# EAGLE design MouseGoggles EyeTrack Hat-1-1 (EAGLE 9.6.2)
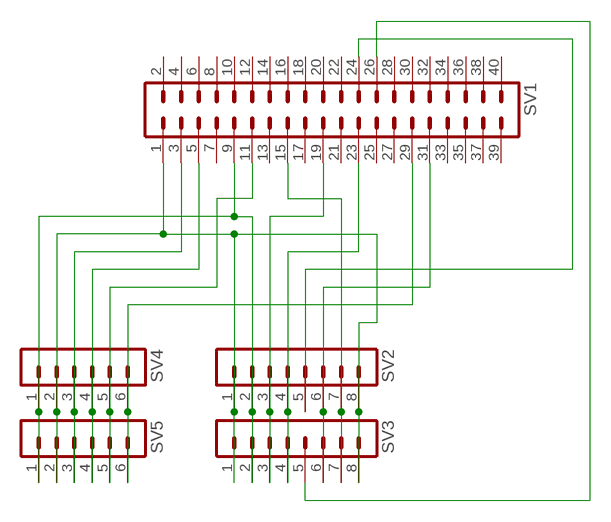
[diagram p0: schematic, sheet 1]

## Parts
SV1  MA20-2  [MA20-2]
SV2  MA08-1  [MA08-1]
SV3  MA08-1  [MA08-1]
SV4  MA06-1  [MA06-1]
SV5  MA06-1  [MA06-1]

## Nets
N$1: SV1.1 SV2.1 SV2.8 SV3.1 SV3.8 SV4.2 SV5.2
N$2: SV1.9 SV2.2 SV3.2 SV4.1 SV5.1
N$3: SV1.19 SV2.3 SV3.3
N$4: SV1.23 SV2.4 SV3.4
N$5: SV1.24 SV2.5
N$6: SV1.26 SV3.5
N$7: SV1.31 SV2.6 SV3.6
N$8: SV1.15 SV2.7 SV3.7
N$9: SV1.3 SV4.3 SV5.3
N$10: SV1.5 SV4.4 SV5.4
N$11: SV1.11 SV4.5 SV5.5
N$12: SV1.29 SV4.6 SV5.6
Unconnected: SV1.2 SV1.4 SV1.6 SV1.7 SV1.8 SV1.10 SV1.12 SV1.13 SV1.14 SV1.16 SV1.17 SV1.18 SV1.20 SV1.21 SV1.22 SV1.25 SV1.27 SV1.28 SV1.30 SV1.32 SV1.33 SV1.34 SV1.35 SV1.36 SV1.37 SV1.38 SV1.39 SV1.40

## Library data of the parts
SV1 = con-lstb:MA20-2: PIN HEADER; OC_FARNELL: unknown; OC_NEWARK: unknown
SV2 SV3 = con-lstb:MA08-1: PIN HEADER; OC_FARNELL: unknown; OC_NEWARK: unknown
SV4 SV5 = con-lstb:MA06-1: PIN HEADER; OC_FARNELL: unknown; OC_NEWARK: unknown

## Board
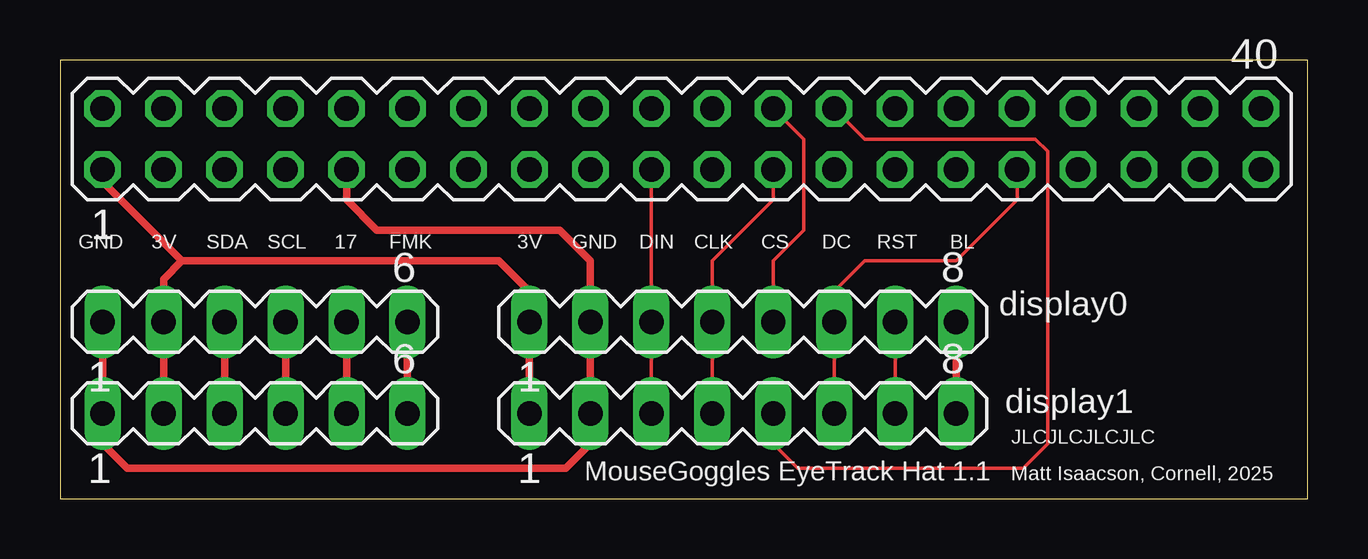
[diagram p1: board, top side]
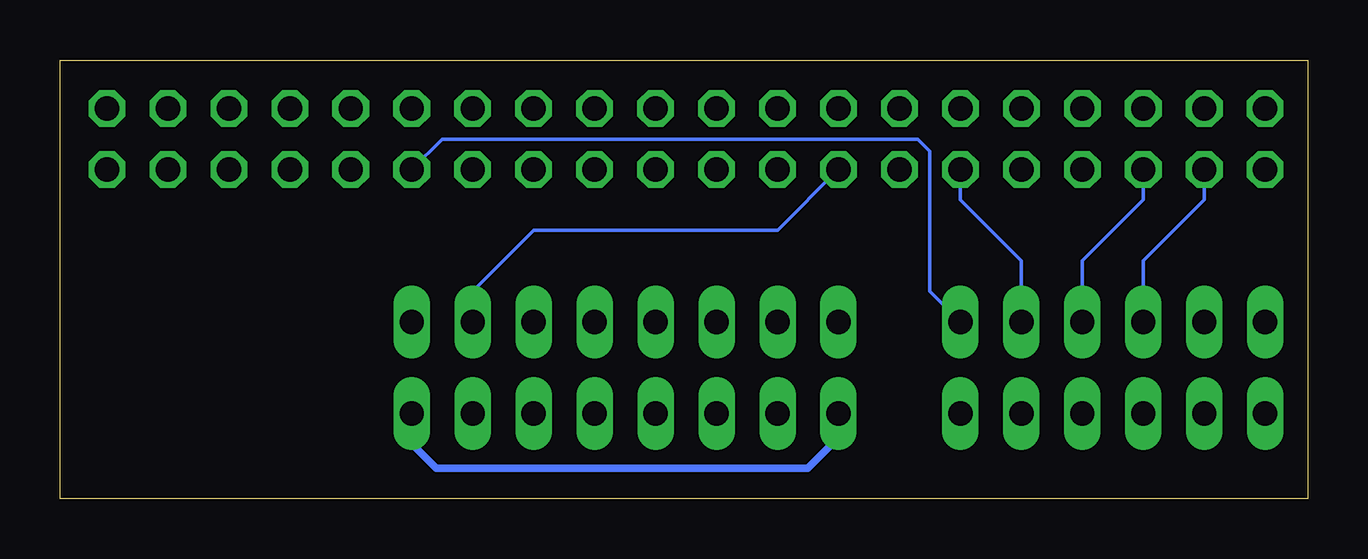
[diagram p2: board, bottom side, seen from below]

Size 51.99 x 18.28 mm. Coordinates in mm from the lower left corner, seen from the top.
Outline: 0,0 51.99,0 51.99,18.28 0,18.28 0,0
Copper layers (1*16): Top 0.035mm / dielectric 1.5mm / Bottom 0.035mm
Design rules "default": minimum track width 6mil, minimum drill 0.35mm, track to track 6mil, track to pad 6mil, pad to pad 6mil, via to via 6mil, smd to smd 6mil, copper to edge 40mil, drill to drill 6mil, minimum pad ring 10mil, minimum via ring 8mil, stop-mask expansion 4mil, vias tented up to drill 0mil, thermal gap 10mil

### Footprints (pad centres in the part's own frame; a part is rotated, then mirrored left to right if it is on the bottom)
MA20-2 = drill 1.016 octagon: 1 -24.13,-1.27; 2 -24.13,1.27; 3 -21.59,-1.27; 4 -21.59,1.27; 5 -19.05,-1.27; 6 -19.05,1.27; 7 -16.51,-1.27; 8 -16.51,1.27; 9 -13.97,-1.27; 10 -13.97,1.27; 11 -11.43,-1.27; 12 -11.43,1.27; 13 -8.89,-1.27; 14 -8.89,1.27; 15 -6.35,-1.27; 16 -6.35,1.27; 17 -3.81,-1.27; 18 -3.81,1.27; 19 -1.27,-1.27; 20 -1.27,1.27; 21 1.27,-1.27; 22 1.27,1.27; 23 3.81,-1.27; 24 3.81,1.27; 25 6.35,-1.27; 26 6.35,1.27; 27 8.89,-1.27; 28 8.89,1.27; 29 11.43,-1.27; 30 11.43,1.27; 31 13.97,-1.27; 32 13.97,1.27; 33 16.51,-1.27; 34 16.51,1.27; 35 19.05,-1.27; 36 19.05,1.27; 37 21.59,-1.27; 38 21.59,1.27; 39 24.13,-1.27; 40 24.13,1.27
MA08-1 = drill 1.016 long: 1 -8.89,0; 2 -6.35,0; 3 -3.81,0; 4 -1.27,0; 5 1.27,0; 6 3.81,0; 7 6.35,0; 8 8.89,0
MA06-1 = drill 1.016 long: 1 -6.35,0; 2 -3.81,0; 3 -1.27,0; 4 1.27,0; 5 3.81,0; 6 6.35,0

### Placement (x,y rotation side)
SV1  25.91,14.99 0 top
SV2  28.45,7.37 0 top
SV3  28.45,3.56 0 top
SV4  8.13,7.37 0 top
SV5  8.13,3.56 0 top

### Tracks (layer width: path | path; a pad name or v marks a point on that pad's centre or on a via)
N$1
  Top 0.305: SV1.1 1.78,13.21 5.08,9.91 | 5.08,9.91 18.29,9.91 19.56,8.64 SV2.1 SV3.1 | SV2.8 SV3.8 | 5.08,9.91 4.32,9.14 SV4.2 SV5.2
  Bottom 0.305: SV3.1 19.56,2.54 20.83,1.27 36.32,1.27 37.34,2.29 SV3.8
N$2
  Top 0.152: SV3.2 22.1,2.29
  Top 0.305: SV1.9 11.94,12.45 13.21,11.18 20.83,11.18 22.1,9.91 SV2.2 SV3.2 | 22.1,2.29 21.08,1.27 2.79,1.27 1.78,2.29 SV5.1 SV4.1
N$3
  Top 0.152: SV1.19 SV2.3 SV3.3
N$4
  Top 0.152: SV1.23 29.72,12.45 27.18,9.91 SV2.4 SV3.4
N$5
  Top 0.152: SV1.24 30.99,14.99 30.99,11.18 29.72,9.91 SV2.5
N$6
  Top 0.152: SV1.26 33.53,14.99 40.64,14.99 41.15,14.48 41.15,2.29 40.13,1.27 30.73,1.27 29.72,2.29 SV3.5
N$7
  Top 0.152: SV1.31 39.88,12.45 37.34,9.91 33.53,9.91 32.26,8.64 SV2.6 SV3.6
N$8
  Top 0.152: SV2.7 SV3.7
  Bottom 0.152: SV1.15 22.1,11.18 32.26,11.18 34.8,8.64 SV2.7
N$9
  Top 0.305: SV4.3 SV5.3
  Bottom 0.152: SV1.3 4.32,12.45 6.86,9.91 SV4.3
N$10
  Top 0.305: SV4.4 SV5.4
  Bottom 0.152: SV1.5 6.86,12.45 9.4,9.91 SV4.4
N$11
  Top 0.305: SV4.5 SV5.5
  Bottom 0.152: SV1.11 14.48,12.45 11.94,9.91 SV4.5
N$12
  Top 0.305: SV4.6 SV5.6
  Bottom 0.152: SV1.29 36.07,14.99 16.26,14.99 15.75,14.48 15.75,8.64 SV4.6

### Text on the board
tNames: GND | 3V | SDA | SCL | 17 | FMK | 3V | GND | DIN | CLK | CS | DC | RST | BL | display0 | display1 | JLCJLCJLCJLC | MouseGoggles EyeTrack Hat 1.1 | Matt Isaacson, Cornell, 2025